# EAGLE design control_board (EAGLE 7.6.0)
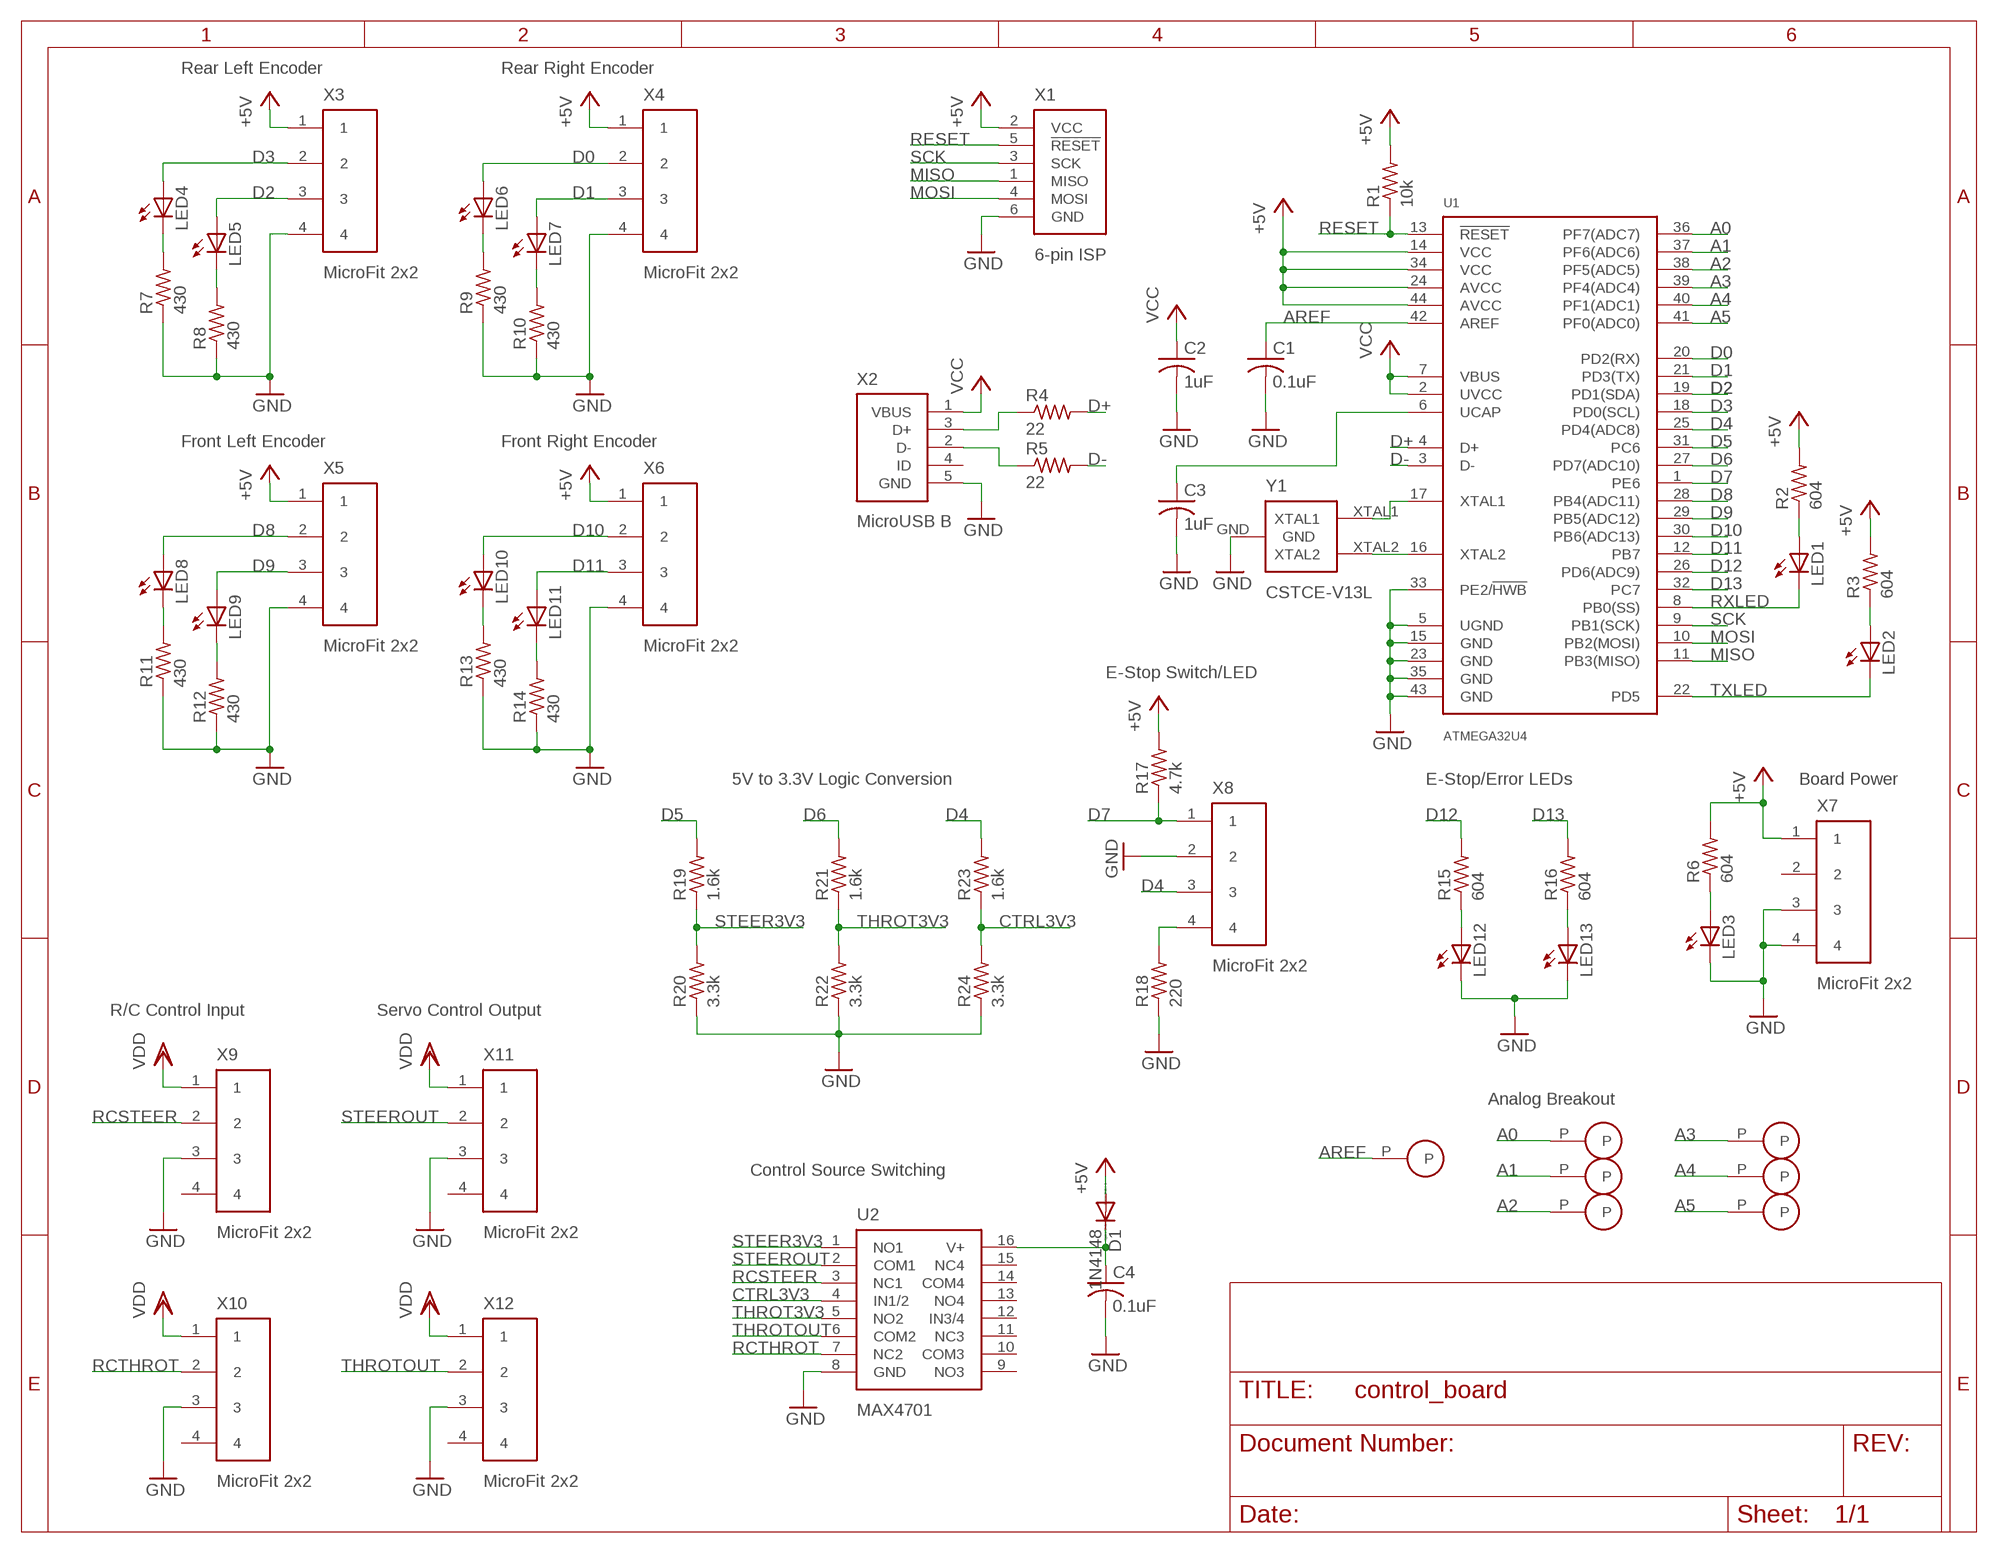
[diagram p0: schematic, sheet 1]

## Parts
C1  0.1uF  C-USC0603  [C0603]
C2  1uF  C-USC0603  [C0603]
C3  1uF  C-USC0603  [C0603]
C4  0.1uF  C-USC0603  [C0603]
D1  1N4148  DIODE-SOD123  [SOD123]
LED1  LEDCHIPLED_0603  [CHIPLED_0603]
LED2  LEDCHIPLED_0603  [CHIPLED_0603]
LED3  LEDCHIPLED_0603  [CHIPLED_0603]
LED4  LEDCHIPLED_0603  [CHIPLED_0603]
LED5  LEDCHIPLED_0603  [CHIPLED_0603]
LED6  LEDCHIPLED_0603  [CHIPLED_0603]
LED7  LEDCHIPLED_0603  [CHIPLED_0603]
LED8  LEDCHIPLED_0603  [CHIPLED_0603]
LED9  LEDCHIPLED_0603  [CHIPLED_0603]
LED10  LEDCHIPLED_0603  [CHIPLED_0603]
LED11  LEDCHIPLED_0603  [CHIPLED_0603]
LED12  LEDCHIPLED_0603  [CHIPLED_0603]
LED13  LEDCHIPLED_0603  [CHIPLED_0603]
P1  100MIL-PAD  [100MIL-PAD]
P2  100MIL-PAD  [100MIL-PAD]
P3  100MIL-PAD  [100MIL-PAD]
P4  100MIL-PAD  [100MIL-PAD]
P5  100MIL-PAD  [100MIL-PAD]
P6  100MIL-PAD  [100MIL-PAD]
P7  100MIL-PAD  [100MIL-PAD]
R1  10k  R-US_R0603  [R0603]
R2  604  R-US_R0603  [R0603]
R3  604  R-US_R0603  [R0603]
R4  22  R-US_R0603  [R0603]
R5  22  R-US_R0603  [R0603]
R6  604  R-US_R0603  [R0603]
R7  430  R-US_R0603  [R0603]
R8  430  R-US_R0603  [R0603]
R9  430  R-US_R0603  [R0603]
R10  430  R-US_R0603  [R0603]
R11  430  R-US_R0603  [R0603]
R12  430  R-US_R0603  [R0603]
R13  430  R-US_R0603  [R0603]
R14  430  R-US_R0603  [R0603]
R15  604  R-US_R0603  [R0603]
R16  604  R-US_R0603  [R0603]
R17  4.7k  R-US_R0603  [R0603]
R18  220  R-US_R0603  [R0603]
R19  1.6k  R-US_R0603  [R0603]
R20  3.3k  R-US_R0603  [R0603]
R21  1.6k  R-US_R0603  [R0603]
R22  3.3k  R-US_R0603  [R0603]
R23  1.6k  R-US_R0603  [R0603]
R24  3.3k  R-US_R0603  [R0603]
U1  ATMEGA32U4  [TQFP-44]
U2  MAX4701  [TSSOP-16]
X1  ISP-HEADER  [ISP-HEADER]
X2  MICRO-USB-B  [MICRO-USB-B]
X3  MICROFIT-2X2-SMD  [MICROFIT-2X2-0430450411]
X4  MICROFIT-2X2-SMD  [MICROFIT-2X2-0430450411]
X5  MICROFIT-2X2-SMD  [MICROFIT-2X2-0430450411]
X6  MICROFIT-2X2-SMD  [MICROFIT-2X2-0430450411]
X7  MICROFIT-2X2-SMD  [MICROFIT-2X2-0430450411]
X8  MICROFIT-2X2-SMD  [MICROFIT-2X2-0430450411]
X9  MICROFIT-2X2-SMD  [MICROFIT-2X2-0430450411]
X10  MICROFIT-2X2-SMD  [MICROFIT-2X2-0430450411]
X11  MICROFIT-2X2-SMD  [MICROFIT-2X2-0430450411]
X12  MICROFIT-2X2-SMD  [MICROFIT-2X2-0430450411]
Y1  CSTCE-V13L  [CSTCE-V13L]

## Nets
+5V: D1.A R1.2 R2.2 R3.2 R6.2 R17.2 U1.14(VCC) U1.24(AVCC) U1.34(VCC) U1.44(AVCC) X1.2(VCC) X3.1 X4.1 X5.1 X6.1 X7.1
A0: P2.P U1.36(PF7(ADC7))
A1: P3.P U1.37(PF6(ADC6))
A2: P4.P U1.38(PF5(ADC5))
A3: P5.P U1.39(PF4(ADC4))
A4: P6.P U1.40(PF1(ADC1))
A5: P7.P U1.41(PF0(ADC0))
AREF: C1.1 P1.P U1.42(AREF)
CTRL3V3: R23.1 R24.2 U2.4(IN1/2)
D0: LED6.A U1.20(PD2(RX)) X4.2
D1: LED7.A U1.21(PD3(TX)) X4.3
D2: LED5.A U1.19(PD1(SDA)) X3.3
D3: LED4.A U1.18(PD0(SCL)) X3.2
D4: R23.2 U1.25(PD4(ADC8)) X8.3
D5: R19.2 U1.31(PC6)
D6: R21.2 U1.27(PD7(ADC10))
D7: R17.1 U1.1(PE6) X8.1
D8: LED8.A U1.28(PB4(ADC11)) X5.2
D9: LED9.A U1.29(PB5(ADC12)) X5.3
D10: LED10.A U1.30(PB6(ADC13)) X6.2
D11: LED11.A U1.12(PB7) X6.3
D12: R15.2 U1.26(PD6(ADC9))
D13: R16.2 U1.32(PC7)
D+: R4.2 U1.4(D+)
D-: R5.2 U1.3(D-)
GND: C1.2 C2.2 C3.2 C4.2 LED3.C LED12.C LED13.C R7.1 R8.1 R9.1 R10.1 R11.1 R12.1 R13.1 R14.1 R18.1 R20.1 R22.1 R24.1 U1.5(UGND) U1.15(GND) U1.23(GND) U1.33(PE2/!HWB!) U1.35(GND) U1.43(GND) U2.8(GND) X1.6(GND) X2.5(GND) X3.4 X4.4 X5.4 X6.4 X7.3 X7.4 X8.2 X9.3 X10.3 X11.3 X12.3 Y1.GND
MISO: U1.11(PB3(MISO)) X1.1(MISO)
MOSI: U1.10(PB2(MOSI)) X1.4(MOSI)
N$1: LED3.A R6.1
N$2: C3.1 U1.6(UCAP)
N$3: LED1.A R2.1
N$4: LED2.A R3.1
N$5: U1.16(XTAL2) Y1.XTAL2
N$6: U1.17(XTAL1) Y1.XTAL1
N$7: LED7.C R10.2
N$8: R5.1 X2.2(D-)
N$9: R4.1 X2.3(D+)
N$10: LED4.C R7.2
N$11: LED6.C R9.2
N$12: LED5.C R8.2
N$13: LED8.C R11.2
N$14: LED9.C R12.2
N$15: LED12.A R15.1
N$16: LED13.A R16.1
N$17: R18.2 X8.4
N$18: LED10.C R13.2
N$19: LED11.C R14.2
N$22: C4.1 D1.C U2.16(V+)
RCSTEER: U2.3(NC1) X9.2
RCTHROT: U2.7(NC2) X10.2
RESET: R1.1 U1.13(!RESET!) X1.5(!RESET!)
RXLED: LED1.C U1.8(PB0(SS))
SCK: U1.9(PB1(SCK)) X1.3(SCK)
STEER3V3: R19.1 R20.2 U2.1(NO1)
STEEROUT: U2.2(COM1) X11.2
THROT3V3: R21.1 R22.2 U2.5(NO2)
THROTOUT: U2.6(COM2) X12.2
TXLED: LED2.C U1.22(PD5)
VCC: C2.1 U1.2(UVCC) U1.7(VBUS) X2.1(VBUS)
VDD: X9.1 X10.1 X11.1 X12.1
Unconnected: U2.9(NO3) U2.10(COM3) U2.11(NC3) U2.12(IN3/4) U2.13(NO4) U2.14(COM4) U2.15(NC4) X2.4(ID) X7.2 X9.4 X10.4 X11.4 X12.4

## Notes on the sheet
- Rear Left Encoder | Rear Right Encoder
- Front Left Encoder | Front Right Encoder
- E-Stop Switch/LED
- 5V to 3.3V Logic Conversion | E-Stop/Error LEDs | Board Power
- R/C Control Input | Servo Control Output
- Analog Breakout
- Control Source Switching

## Library data of the parts
C1-C4 = resistor:C-US: CAPACITOR, American symbol
D1 = diode:DIODE-: DIODE
LED1-LED13 = led:LED: LED OSRAM: - CHIPLED LG R971, LG N971, LY N971, LG Q971, LY Q971, LO R971, LY R971 LH N974, LH R974 LS Q976, LO Q976, LY Q976 LO Q996 - Hyper CHIPLED LW Q18S LB Q993, LB Q99A, LB R99A - SideLED LS A670, LO A670, LY A670, LG A670, LP A670 LB A673, LV A673, LT A673, LW A673 LH A674 LY A675 LS A676, LA A676, LO A676, LY A676, LW A676 LS A679, LY A679, LG A679 - Hyper Micro SIDELED® LS Y876, LA Y876, LO Y876, LY Y876 LT Y87S - SmartLED LW L88C, LW L88S LB L89C, LB L89S, LG L890 LS L89K, LO L89K, LY L89K LS L896, LA L896, LO L896, LY L896 - TOPLED LS T670, LO T670, LY T670, LG T670, LP T670 LSG T670, LSP T670, LSY T670, LOP T670, LYG T670 LG T671, LOG T671, LSG T671 LB T673, LV T673, LT T673, LW T673 LH T674 LS T676, LA T676, LO T676, LY T676, LB T676, LH T676, LSB T676, LW T676 LB T67C, LV T67C, LT T67C, LS T67K, LO T67K, LY T67K, LW E67C LS E67B, LA E67B, LO E67B, LY E67B, LB E67C, LV E67C, LT E67C LW T67C LS T679, LY T679, LG T679 LS T770, LO T770, LY T770, LG T770, LP T770 LB T773, LV T773, LT T773, LW T773 LH T774 LS E675, LA E675, LY E675, LS T675 LS T776, LA T776, LO T776, LY T776, LB T776 LHGB T686 LT T68C, LB T68C - Hyper Mini TOPLED® LB M676 - Mini TOPLED Santana® LG M470 LS M47K, LO M47K, LY M47K Source: http://www.osram.convergy.de LUXEON: - LUMILED® LXK2-PW12-R00, LXK2-PW12-S00, LXK2-PW14-U00, LXK2-PW14-V00 LXK2-PM12-R00, LXK2-PM12-S00, LXK2-PM14-U00 LXK2-PE12-Q00, LXK2-PE12-R00, LXK2-PE12-S00, LXK2-PE14-T00, LXK2-PE14-U00 LXK2-PB12-K00, LXK2-PB12-L00, LXK2-PB12-M00, LXK2-PB14-N00, LXK2-PB14-P00, LXK2-PB14-Q00 LXK2-PR12-L00, LXK2-PR12-M00, LXK2-PR14-Q00, LXK2-PR14-R00 LXK2-PD12-Q00, LXK2-PD12-R00, LXK2-PD12-S00 LXK2-PH12-R00, LXK2-PH12-S00 LXK2-PL12-P00, LXK2-PL12-Q00, LXK2-PL12-R00 Source: www.luxeon.com KINGBRIGHT: KA-3528ASYC Source: www.kingbright.com
P1-P7 = rover12:100MIL-PAD
R1-R24 = resistor:R-US_: RESISTOR, American symbol
U1 = rover12:ATMEGA32U4
U2 = rover12:MAX4701
X1 = rover12:ISP-HEADER
X2 = rover12:MICRO-USB-B
X3-X12 = rover12:MICROFIT-2X2-SMD
Y1 = rover12:CSTCE-V13L

## Board
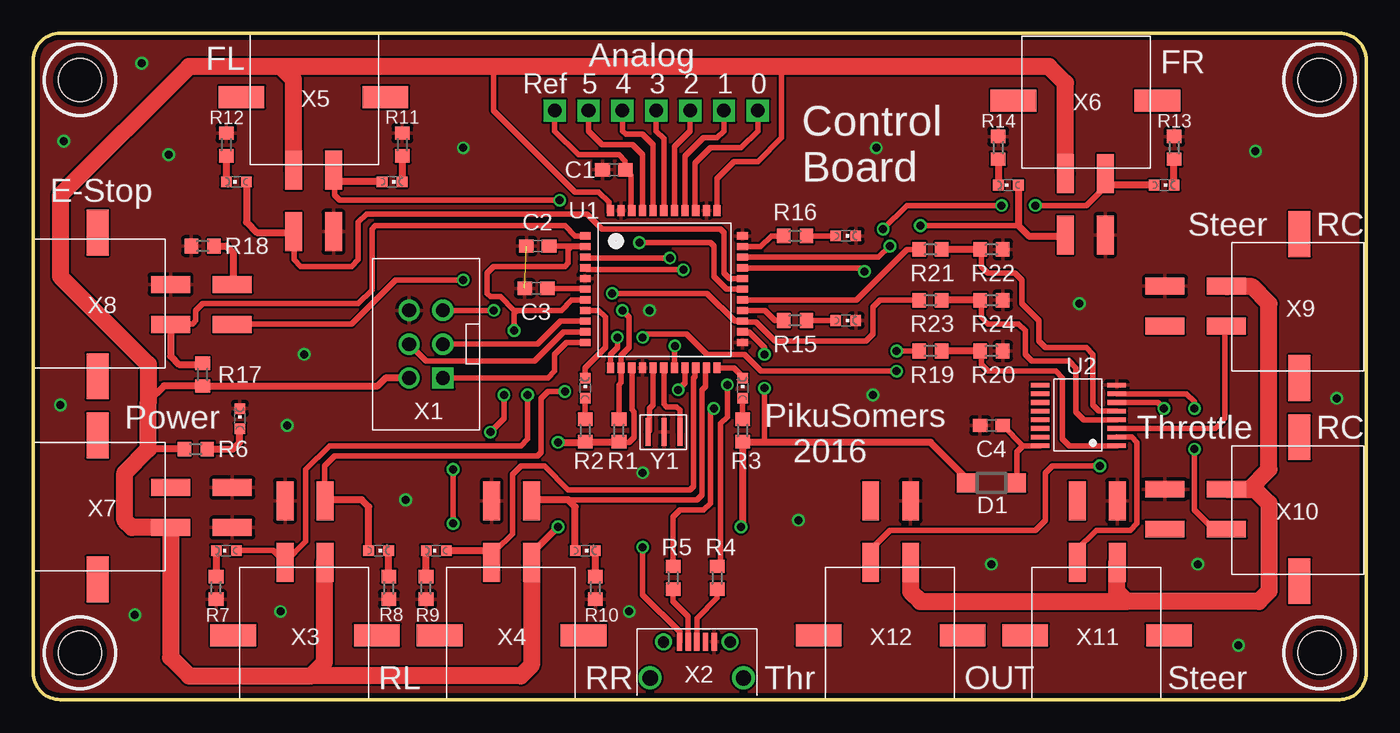
[diagram p1: board, top side]
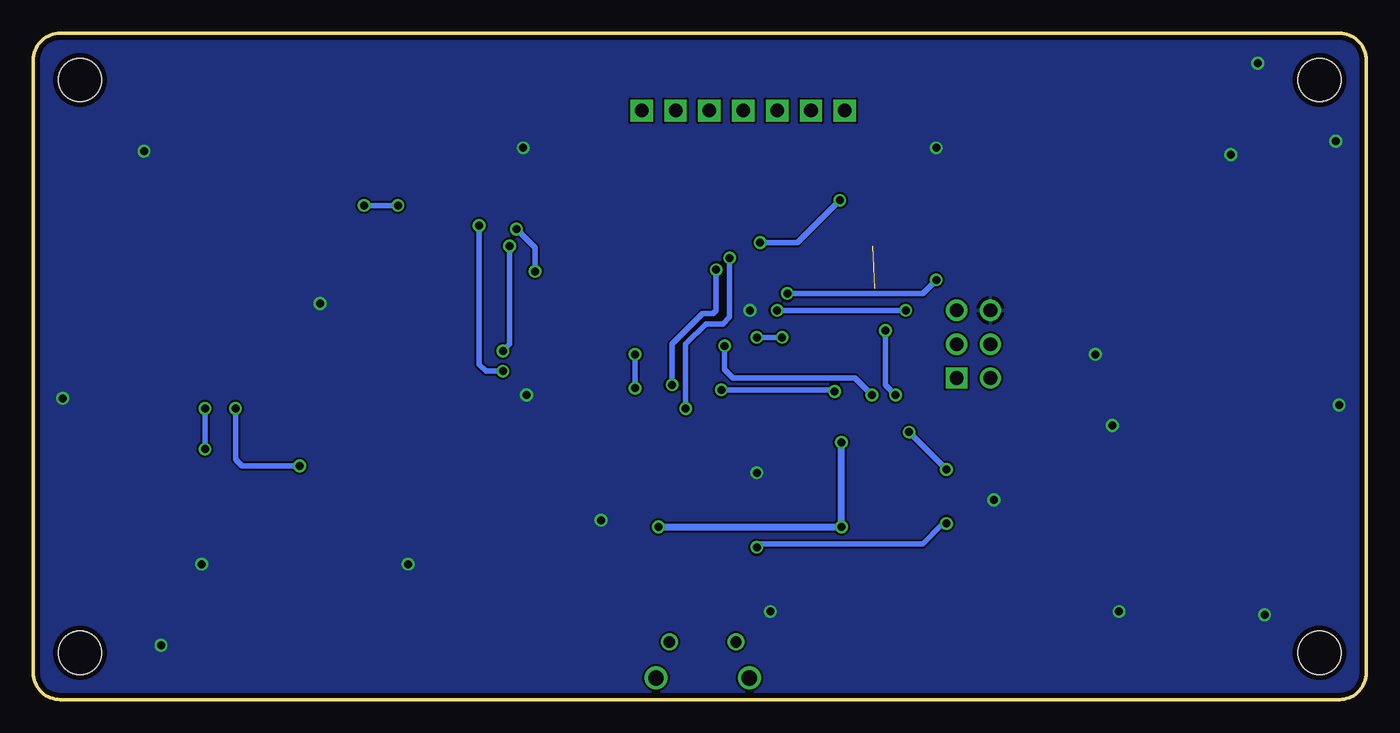
[diagram p2: board, bottom side, seen from below]

Size 100 x 50 mm. Coordinates in mm from the lower left corner, seen from the top.
Outline: 0,2 arc90 2,0 98,0 arc90 100,2 100,48 arc90 98,50 2,50 arc90 0,48 0,2
Copper layers (1*16): Top 0.0356mm / dielectric 1.5011mm / Bottom 0.0356mm
Design rules "oshpark-2layer": minimum track width 6mil, minimum drill 13mil, track to track 6mil, track to pad 6mil, pad to pad 6mil, via to via 6mil, smd to smd 6mil, copper to edge 15mil, drill to drill 6mil, minimum pad ring 7mil, minimum via ring 7mil, stop-mask expansion 2.5mil, vias tented up to drill 0mil, thermal gap 10mil
Holes 3.26 mm at 3.5,3.5 3.5,46.5 96.5,46.5 96.5,3.5

### Footprints (pad centres in the part's own frame; a part is rotated, then mirrored left to right if it is on the bottom)
C0603 = smd 1.1 x 1: 1 -0.85,0; 2 0.85,0
SOD123 = smd 1.4 x 1.4: A 1.9,0; C -1.9,0
CHIPLED_0603 = smd 0.8 x 0.8: A 0,-0.75; C 0,0.75
100MIL-PAD = drill 1.016 pad 1.676 square: P 0,0
R0603 = smd 1 x 1.1: 1 -0.85,0; 2 0.85,0
TQFP-44 = smd 0.8 x 0.54: 1 0,0; 2 0,-0.8; 3 0,-1.6; 4 0,-2.4; 5 0,-3.2; 6 0,-4; 7 0,-4.8; 8 0,-5.6; 9 0,-6.4; 10 0,-7.2; 11 0,-8; 23 11.8,-8; 24 11.8,-7.2; 25 11.8,-6.4; 26 11.8,-5.6; 27 11.8,-4.8; 28 11.8,-4; 29 11.8,-3.2; 30 11.8,-2.4; 31 11.8,-1.6; 32 11.8,-0.8; 33 11.8,0 | smd 0.54 x 0.8: 12 1.9,-9.9; 13 2.7,-9.9; 14 3.5,-9.9; 15 4.3,-9.9; 16 5.1,-9.9; 17 5.9,-9.9; 18 6.7,-9.9; 19 7.5,-9.9; 20 8.3,-9.9; 21 9.1,-9.9; 22 9.9,-9.9; 34 9.9,1.9; 35 9.1,1.9; 36 8.3,1.9; 37 7.5,1.9; 38 6.7,1.9; 39 5.9,1.9; 40 5.1,1.9; 41 4.3,1.9; 42 3.5,1.9; 43 2.7,1.9; 44 1.9,1.9
TSSOP-16 = smd 0.35 x 1.4: 1 0,0; 2 0.65,0; 3 1.3,0; 4 1.95,0; 5 2.6,0; 6 3.25,0; 7 3.9,0; 8 4.55,0; 9 4.55,5.75; 10 3.9,5.75; 11 3.25,5.75; 12 2.6,5.75; 13 1.95,5.75; 14 1.3,5.75; 15 0.65,5.75; 16 0,5.75
ISP-HEADER = drill 1.02 pad 1.6 square: 1 0,0 | drill 1.02 pad 1.6: 2 0,2.54; 3 2.54,0; 4 2.54,2.54; 5 5.08,0; 6 5.08,2.54
MICRO-USB-B = smd 0.4 x 1.35: 1 -1.3,0; 2 -0.65,0; 3 0,0; 4 0.65,0; 5 1.3,0 | drill 0.85 pad 1.25: NC1 -2.5,0; NC2 2.5,0 | drill 1.15 pad 1.55: NC3 -3.5,-2.7; NC4 3.5,-2.7
MICROFIT-2X2-0430450411 = smd 1.27 x 2.921: 1 6.896,5.474; 2 3.899,5.474; 3 6.896,10.097; 4 3.899,10.097 | smd 3.429 x 1.651: NC1 0,0; NC2 10.795,0
CSTCE-V13L = smd 0.4 x 2.1: GND 1.2,0; XTAL1 0,0; XTAL2 2.4,0

### Placement (x,y rotation side)
C1  43.56,39.75 180 top
C2  37.85,34.04 180 top
C3  37.72,30.86 180 top
C4  71.88,20.57 180 top
D1  71.88,16.26 180 top
LED1  41.4,23.37 0 top
LED2  53.21,23.37 0 top
LED3  15.49,21.08 0 top
LED4  14.48,11.18 90 top
LED5  25.91,11.18 270 top
LED6  30.23,11.18 90 top
LED7  41.4,11.18 270 top
LED8  26.92,38.86 270 top
LED9  15.24,38.86 90 top
LED10  84.84,38.61 270 top
LED11  73.15,38.61 90 top
LED12  60.96,28.45 270 top
LED13  60.96,34.8 270 top
P1  39.12,44.2 0 top
P2  54.36,44.2 270 top
P3  51.82,44.2 270 top
P4  49.28,44.2 270 top
P5  46.74,44.2 270 top
P6  44.2,44.2 270 top
P7  41.66,44.2 270 top
R1  43.94,20.19 270 top
R2  41.4,20.19 270 top
R3  53.21,20.19 270 top
R4  51.31,9.14 90 top
R5  48.01,9.14 90 top
R6  12.19,18.8 180 top
R7  13.72,8.38 90 top
R8  26.67,8.38 90 top
R9  29.46,8.38 90 top
R10  42.16,8.38 90 top
R11  27.69,41.66 270 top
R12  14.48,41.66 270 top
R13  85.6,41.4 270 top
R14  72.39,41.4 270 top
R15  57.15,28.45 180 top
R16  57.15,34.8 180 top
R17  12.7,24.38 270 top
R18  12.7,34.04 0 top
R19  67.31,26.16 180 top
R20  71.88,26.16 180 top
R21  67.31,33.78 180 top
R22  71.88,33.78 180 top
R23  67.31,29.97 180 top
R24  71.88,29.97 180 top
U1  41.4,34.8 0 top
U2  81.28,19.05 90 top
X1  30.73,24.13 90 top
X2  49.78,4.32 0 top
X3  14.99,4.83 0 top
X4  30.48,4.83 0 top
X5  26.42,45.21 180 top
X6  84.33,44.96 180 top
X7  4.83,19.81 270 top
X8  4.83,35.05 270 top
X9  95,24.13 90 top
X10  95,8.89 90 top
X11  74.42,4.83 0 top
X12  58.93,4.83 0 top
Y1  48.51,20.07 180 top

### Tracks (layer width: path | path; a pad name or v marks a point on that pad's centre or on a via)
+5V  (via drill 0.6)
  Top 0.406: U1.14 44.9,21.77 45.09,21.59 45.09,19.68 44.7,19.3 43.98,19.3 R1.2 | U1.34 51.3,39.11 52.58,40.39 54.36,40.39 56.13,42.16 56.13,47.5 | U1.44 43.18,36.58 43.18,37.34 42.42,38.1 40.64,38.1 34.54,44.2 34.54,47.5 | U1.24 53.68,27.6 54.86,26.42 v54.86,25.91 | v54.86,23.37 54.86,19.3
  Top 0.508: R6.2 8.64,18.8 | X4.1 37.38,10.96 v39.37,12.95 | v39.37,19.3 41.36,19.3 R2.2 R1.2 | 12.87,23.37 12.74,23.5 | 8.64,22.35 9.82,23.53 R17.2 12.74,23.5 | X1.2 26.42,24.13 25.78,23.5 12.74,23.5 | D1.A 69.98,16.63 67.31,19.3 54.86,19.3 53.25,19.3 R3.2 53.21,13.08 v53.09,12.95
  Top 1.27: 20.83,1.78 11.68,1.78 10.3,3.16 X7.1 7.4,12.92 6.86,13.46 6.86,17.02 8.64,18.8 8.64,22.35 8.64,25.15 2.03,31.75 2.03,37.85 11.68,47.5 18.54,47.5 | 20.83,1.78 21.84,2.79 21.84,10.26 X3.1 | X4.1 37.38,2.58 36.58,1.78 20.83,1.78 | X5.1 19.52,46.52 18.54,47.5 | X6.1 77.43,46.27 76.2,47.5 56.13,47.5 34.54,47.5 18.54,47.5
  Bottom 0.406: v54.86,25.91 v54.86,23.37
  Bottom 0.508: v39.37,19.3 v39.37,12.95 v53.09,12.95
A0
  Top 0.406: P2.P 54.36,42.67 53.09,41.4 50.8,41.4 49.66,40.26 49.66,36.74 U1.36
A1
  Top 0.406: U1.37 48.9,40.77 50.29,42.16 51.31,42.16 51.82,42.67 P3.P
A2
  Top 0.406: U1.38 48.1,41.5 49.28,42.67 P4.P
A3
  Top 0.406: U1.39 47.3,42.11 46.74,42.67 P5.P
A4
  Top 0.406: U1.40 46.5,41.64 45.72,42.42 44.45,42.42 44.2,42.67 P6.P
A5
  Top 0.406: U1.41 45.7,40.91 44.96,41.66 42.67,41.66 41.66,42.67 P7.P
AREF
  Top 0.406: U1.42 44.83,36.77 44.83,39.33 C1.1 44.41,40.42 43.94,40.89 40.89,40.89 39.12,42.67 P1.P
CTRL3V3
  Top 0.406: U2.4 78.82,21 78.23,21.59 78.23,24.89 77.72,25.4 74.93,25.4 74.42,25.91 74.42,27.69 73.91,28.19 71.63,28.19 71.12,28.7 71.12,29.88 R24.2
  Top 0.508: R24.2 R23.1
D0
  Top 0.406: 33.78,11.18 34.67,11.18 35.94,12.45 35.94,16.89 36.58,17.53 38.35,17.53 40.13,15.75 49.28,15.75 49.53,16 49.53,24.13 49.66,24.26 49.66,24.85 U1.20 49.78,24.82
  Top 0.508: LED6.A 33.78,11.18 34.04,10.92 34.04,10.64 X4.2
D1
  Top 0.406: 40.13,14.99 49.78,14.99 50.16,15.37 50.16,23.24 50.42,23.5 50.42,24.82 U1.21 50.55,24.85
  Top 0.508: LED7.A 40.65,14.47 40.13,14.99 37.44,14.99 X4.3
D2  (via drill 0.6)
  Top 0.406: U1.19 48.9,23.76 v48.39,23.24 | v39.88,23.11 38.61,23.11 38.1,22.61 38.1,18.54 37.85,18.29 22.61,18.29 21.84,17.53 21.84,14.96 X3.3
  Top 0.508: LED5.A 25.16,14.47 24.64,14.99 21.95,14.99 X3.3
  Bottom 0.406: v48.39,23.24 40.01,23.24 v39.88,23.11
D3  (via drill 0.6)
  Top 0.406: U1.18 48.1,26.51 v48.13,26.54 | v37.08,22.86 37.08,19.56 36.58,19.05 22.23,19.05 20.45,17.27 20.45,11.86 X3.2 18.01,11.18 LED4.A
  Bottom 0.406: v48.13,26.54 48.13,24.77 47.5,24.13 38.35,24.13 v37.08,22.86
D4  (via drill 0.6)
  Top 0.406: R23.2 63.5,29.97 62.99,29.46 62.99,27.43 62.48,26.92 55.63,26.92 54.23,28.32 53.28,28.32 U1.25 52.63,28.4 50.55,30.48 v43.43,30.48 | X8.3 14.96,28.19 23.88,28.19 27.18,31.5 v32.26,31.5
  Bottom 0.406: v43.43,30.48 33.27,30.48 v32.26,31.5
D5  (via drill 0.6)
  Top 0.406: U1.31 63.42,33.2 v64.26,34.04 | v64.77,26.16 R19.2
  Bottom 0.406: v64.26,34.04 64.26,26.67 v64.77,26.16
D6
  Top 0.406: U1.27 61.75,30 65.53,33.78 R21.2
D7
  Top 0.406: U1.1 40.64,34.8 39.88,35.56 25.65,35.56 25.4,35.31 25.4,30.73 24.38,29.72 12.7,29.72 12.19,29.21 12.19,28.45 11.94,28.19 10.34,28.19 X8.1
  Top 0.508: X8.1 10.3,25.77 10.92,25.15 12.61,25.15 R17.1
D8  (via drill 0.6)
  Top 0.406: U1.28 52.01,30.8 51.05,31.75 51.05,34.04 50.8,34.29 v45.47,34.29 | v39.5,37.47 22.99,37.47 22.61,37.85 22.61,38.61 22.86,38.86
  Top 0.508: LED8.A 22.86,38.86 22.61,39.12 22.61,39.65 X5.2
  Bottom 0.406: v45.47,34.29 42.67,34.29 v39.5,37.47
D9
  Top 0.406: U1.29 52.22,31.6 51.82,32 51.82,35.05 51.56,35.31 42.67,35.31 41.53,36.45 25.02,36.45 24.38,35.81 24.38,33.02 23.88,32.51 20.07,32.51 19.56,33.02 19.56,34.51 19.52,34.54 | 19.56,35.15 X5.3
  Top 0.508: 19.52,34 19.52,34.54 X5.3 19.46,35.05 16.76,35.05 15.99,35.83 LED9.A
D10  (via drill 0.6)
  Top 0.406: U1.30 62.09,32.4 v62.36,32.13 | v63.75,35.31 65.53,37.08 v72.64,37.08 | v75.18,37.08 78.99,37.08 80.64,38.73
  Top 0.508: LED10.A 80.77,38.61 80.64,38.73 80.52,38.86 80.52,39.4 X6.2
  Bottom 0.406: v62.36,32.13 62.36,33.91 v63.75,35.31 | v72.64,37.08 v75.18,37.08
D11  (via drill 0.6)
  Top 0.406: 73.9,35.57 v66.56,35.57 | v64.77,24.64 54.61,24.64 53.34,25.91 50.55,25.91 49.02,27.43 45.97,27.43 v45.72,27.18 | U1.12 43.31,25.91 43.81,26.42 v43.81,27.18
  Top 0.508: LED11.A 73.9,35.57 74.68,34.8 77.37,34.8 X6.3
  Bottom 0.406: v66.56,35.57 66.56,25.16 66.04,24.64 v64.77,24.64 | v43.81,27.18 v45.72,27.18
D12
  Top 0.406: U1.26 54.88,29.2 55.63,28.45 R15.2
D13
  Top 0.406: U1.32 54.57,34 55.37,34.8 R16.2
D+  (via drill 0.6)
  Top 0.406: v48.77,32.26 41.54,32.26 U1.4 | R4.2 51.56,10.25 51.56,20.7 52.07,21.21 v52.07,23.62
  Bottom 0.406: v52.07,23.62 52.07,26.67 49.78,28.96 49.02,28.96 48.77,29.21 v48.77,32.26
D-  (via drill 0.6)
  Top 0.406: R5.2 48.01,13.72 48.51,14.22 50.29,14.22 50.8,14.73 50.8,21.59 v51.05,21.84 | v47.75,33.15 41.45,33.15 U1.3
  Bottom 0.406: v51.05,21.84 51.05,26.67 49.53,28.19 48.26,28.19 47.75,28.7 v47.75,33.15
GND  (via drill 0.6)  (1 unrouted)
  other vias: 46.23,29.21 45.72,17.02 2.29,41.91 10.16,40.89 8.13,47.75 32.26,41.4 63.25,41.4 62.99,22.86 78.49,29.72 91.69,41.15 57.4,13.46 71.88,10.16 87.38,10.16 90.42,4.06 97.79,22.61 20.32,25.91 19.05,20.57 27.94,14.99 44.7,6.6 2.03,22.1 7.62,6.35 18.54,6.6
  pour Bottom: 2.03,50.04 arc90 0,48.01 0,45.97 0,2.03 arc90 2.03,0 2.54,0 98.04,0 arc90 100.08,2.03 100.08,4.83 100.08,48.01 arc90 98.04,50.04 97.28,50.04
  pour Top: 2.03,50.04 arc90 0,48.01 0,45.97 0,2.03 arc90 2.03,0 2.54,0 98.04,0 arc90 100.08,2.03 100.08,4.83 100.08,48.01 arc90 98.04,50.04 97.28,50.04
MISO
  Top 0.406: U1.11 40.01,26.8 39.12,25.91 39.12,24.64 38.61,24.13 X1.1
MOSI
  Top 0.406: U1.10 39.79,27.6 37.59,25.4 29.46,25.4 X1.4
N$1
  Top 0.508: R6.1 14.99,18.8 15.49,19.3 LED3.A
N$2
  Top 0.406: C3.1 41.34,30.86 U1.6
N$3
  Top 0.406: R2.1 LED1.A
N$4
  Top 0.406: R3.1 LED2.A
N$5
  Top 0.406: U1.16 46.5,22.12 46.23,21.84 46.23,20.18 Y1.XTAL2
N$6
  Top 0.406: U1.17 47.3,22.17 47.5,21.97 48.26,21.97 48.51,21.72 Y1.XTAL1
N$7
  Top 0.508: R10.2 42.16,11.16 LED7.C
N$8
  Top 0.406: X2.2 49.13,6.24 48.01,7.37 R5.1
N$9
  Top 0.406: X2.3 49.78,6.1 51.31,7.62 R4.1
N$10
  Top 0.508: LED4.C 13.73,9.24 R7.2
N$11
  Top 0.508: R9.2 29.46,11.16 LED6.C
N$12
  Top 0.508: R8.2 26.67,11.16 LED5.C
N$13
  Top 0.508: R11.2 27.69,38.87 LED8.C
N$14
  Top 0.508: R12.2 14.48,38.87 LED9.C
N$15
  Top 0.406: R15.1 LED12.A
N$16
  Top 0.406: R16.1 LED13.A
N$17
  Top 0.508: R18.2 14.48,34.04 14.99,33.53 14.99,31.22 X8.4
N$18
  Top 0.508: LED10.C 85.59,40.54 R13.2
N$19
  Top 0.508: R14.2 LED11.C
N$22
  Top 0.406: U2.16 74.26,19.05 | 74.26,19.05 C4.1 | D1.C 73.78,18.58 74.26,19.05
RCSTEER
  Top 0.406: U2.3 88.68,20.35 89.41,21.08 89.41,27.91 X9.2
RCTHROT  (via drill 0.6)
  Top 0.406: U2.7 86.52,22.95 87.12,22.35 v87.12,21.84 | v87.12,18.8 87.12,14.22 88.65,12.7 89.43,12.7 X10.2
  Bottom 0.406: v87.12,21.84 v87.12,18.8
RESET  (via drill 0.6)
  Top 0.406: R1.1 43.94,23.62 44.1,23.78 U1.13 44.1,25.81 44.7,26.42 44.7,28.7 v44.2,29.21 | v34.54,29.21 X1.5
  Bottom 0.406: v44.2,29.21 v34.54,29.21
RXLED
  Top 0.406: LED1.C 41.4,24.89 42.93,26.42 42.93,28.7 42.42,29.21 41.41,29.21 U1.8
SCK
  Top 0.406: U1.9 39.57,28.4 37.85,26.67 X1.3
STEER3V3
  Top 0.406: U2.1 77.72,19.05 77.22,19.56 77.22,24.13 76.71,24.64 71.63,24.64 71.12,25.15 71.12,26.07 R20.2
  Top 0.508: R20.2 R19.1
STEEROUT
  Top 0.406: U2.2 82.41,19.7 82.8,19.3 82.8,13.21 82.3,12.7 79.76,12.7 78.23,11.18 78.23,10.39 X11.2
THROT3V3
  Top 0.406: U2.5 79.95,21.65 79.5,22.1 79.5,25.91 78.99,26.42 75.95,26.42 75.44,26.92 75.44,28.45 74.17,29.72 74.17,31.5 73.66,32 71.63,32 71.12,32.51 71.12,33.69 R22.2
  Top 0.508: R22.2 R21.1
THROTOUT  (via drill 0.6)
  Top 0.406: U2.6 84.38,22.3 v84.84,21.84 | v80.01,17.53 76.45,17.53 75.95,17.02 75.95,13.46 75.18,12.7 64.26,12.7 62.99,11.43 62.99,10.46 X12.2
  Bottom 0.406: v84.84,21.84 84.84,18.03 84.33,17.53 v80.01,17.53
TXLED
  Top 0.406: LED2.C 53.21,24.26 52.58,24.89 U1.22
VCC  (via drill 0.6)
  Top 0.406: C2.1 41.36,34.04 U1.2 40.35,34 40.13,33.78 40.13,32.77 39.88,32.51 34.54,32.51 34.04,32 34.04,30.48 34.29,30.23 35.05,30.23 36.07,29.21 36.32,29.21 | U1.7 41.38,29.97 40.39,29.97 39.62,29.21 36.32,29.21 | 36.32,29.21 36.07,28.96 v36.07,27.69 | v35.31,22.86 35.31,21.08 v34.29,20.07 | v31.5,17.27 v31.5,13.21 | v45.72,11.43 45.72,7.87 48.51,5.08 48.51,4.35 X2.1
  Bottom 0.406: v36.07,27.69 36.07,23.62 v35.31,22.86 | v34.29,20.07 v31.5,17.27 | v31.5,13.21 31.75,13.21 33.27,11.68 45.47,11.68 v45.72,11.43
VDD
  Top 1.27: X9.1 89.56,30.99 91.44,30.99 92.71,29.72 92.71,17.27 91.22,15.79 X10.1 91.66,15.79 92.71,14.73 92.71,8.13 91.95,7.37 82.04,7.37 | 82.04,7.37 81.28,8.13 81.28,10.26 X11.1 | X12.1 65.82,8.09 66.55,7.37 82.04,7.37

### Text on the board
tPlace: FL | Analog | FR | Ref | 5 | 4 | 3 | 2 | 1 | 0 | Control / Board | E-Stop | Steer | RC | Power | Throttle | RC | PikuSomers / 2016 | RL | RR | Thr | OUT | Steer